# Altium project TemCtrl.PrjPCB
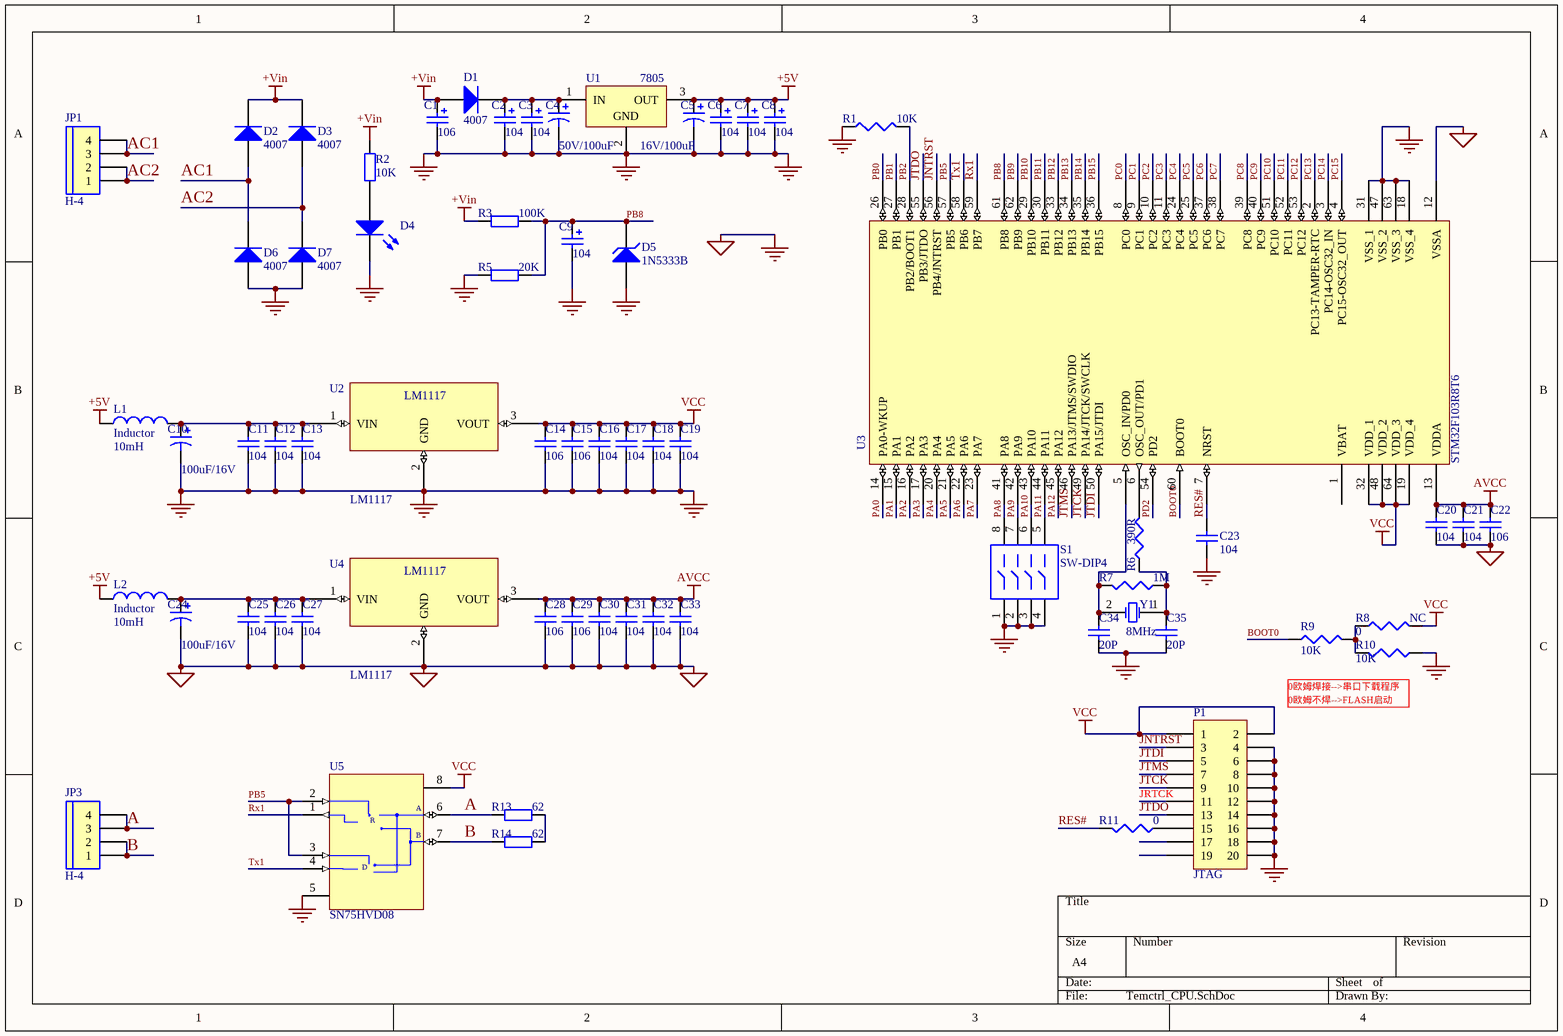
[diagram p0: Temctrl_CPU.SchDoc]
3 sheets, 243 parts. Net scope: global (net labels, ports and power ports of the same name join across sheets).
Board file: Temctrl.PcbDoc
Sheets:
  Temctrl_CPU.SchDoc
  Temctrl_I.SchDoc
  Temctrl_O.SchDoc

## Sheet Temctrl_CPU.SchDoc
size A4

### Parts
C1  106  [0805]
C2  104  [0805]
C3  104  [0805]
C4  50V/100uF  [50V/100uF SOC]
C5  16V/100uF  [100/16V   SOC]
C6  104  [0805]
C7  104  [0805]
C8  104  [0805]
C9  104  [0805]
C10  100uF/16V  [100/16V   SOC]
C11  104  [0805]
C12  104  [0805]
C13  104  [0805]
C14  106  [0805]
C15  106  [0805]
C16  104  [0805]
C17  104  [0805]
C18  104  [0805]
C19  104  [0805]
C20  104  [0805]
C21  104  [0805]
C22  106  [0805]
C23  104  [0805]
C24  100uF/16V  [100/16V   SOC]
C25  104  [0805]
C26  104  [0805]
C27  104  [0805]
C28  106  [0805]
C29  106  [0805]
C30  104  [0805]
C31  104  [0805]
C32  104  [0805]
C33  104  [0805]
C34  20P  [0805]
C35  20P  [0805]
D1  4007  [DIODE0.4]
D2  4007  [DIODE0.4]
D3  4007  [DIODE0.4]
D4  LED0  [LED0.1-0.22]  (value not drawn)
D5  1N5333B  [DIODE0.4]
D6  4007  [DIODE0.4]
D7  4007  [DIODE0.4]
JP1  H-4  [P4]
JP3  H-4  [P4]
L1  Inductor  value 10mH  [0805]
L2  Inductor  value 10mH  [0805]
P1  JTAG  [HDR2X10]
R1  10K  [0805]
R2  10K  [0805]
R3  100K  [0805]
R5  20K  [0805]
R6  390R  [0805]
R7  1M  [0805]
R8  NC  value 0  [0805]
R9  10K  [0805]
R10  10K  [0805]
R11  0  [0805]
R13  62  [0805]
R14  62  [0805]
S1  SW-DIP4  [SW-DIP-4]
U1  7805  [SIP-W3 /SRQ25]
U2  LM1117  [DSO-G3/P2.3]
U3  STM32F103R8T6  [LQFP64_N]
U4  LM1117  [DSO-G3/P2.3]
U5  SN75HVD08  [SOP8-max485]
Y1  value 8MHz  [XTL]  (hidden comment: XTAL)

### Nets
+5V: C5.1 C6.1 C7.1 C8.1 L1.1 L2.1 U1.3(OUT)
+Vin: C1.1 D1.1(A) D2.2(K) D3.2(K) R2.1 R3.2
AGND: C1.2 C2.2 C3.2 C4.2 C5.2 C6.2 C7.2 C8.2 C9.2 C10.2 C11.2 C12.2 C13.2 C14.2 C15.2 C16.2 C17.2 C18.2 C19.2 C20.1 C21.1 C22.1 C23.2 C24.2 C25.2 C26.2 C27.2 C28.2 C29.2 C30.2 C31.2 C32.2 C33.2 C34.1 C35.1 D4.2(K) D5.1(A) D6.1(A) D7.1(A) P1.4 P1.6 P1.8 P1.10 P1.12 P1.14 P1.16 P1.18 P1.20 R1.1 R5.2 R10.1 S1.1 S1.2 S1.3 S1.4 U1.2(GND) U2.2(GND) U3.12(VSSA) U3.18(VSS_4) U3.31(VSS_1) U3.47(VSS_2) U3.63(VSS_3) U4.2(GND) U5.5(GND)  [also labelled GND]
AVCC: C20.2 C21.2 C22.2 C28.1 C29.1 C30.1 C31.1 C32.1 C33.1 U3.13(VDDA) U4.3(VOUT)
VCC: C14.1 C15.1 C16.1 C17.1 C18.1 C19.1 P1.1 P1.2 R8.2 U2.3(VOUT) U3.19(VDD_4) U3.32(VDD_1) U3.48(VDD_2) U3.64(VDD_3) U5.8(VCC)
A: JP3.3 JP3.4 R13.2 U5.6(A)
AC1: D2.1(A) D6.2(K) JP1.3 JP1.4
AC2: D3.1(A) D7.2(K) JP1.1 JP1.2
B: JP3.1 JP3.2 R14.2 U5.7(B)
BOOT0: R9.1 U3.60(BOOT0)
JNTRST: P1.3 U3.56(PB4/JNTRST)
JTCK: P1.9 U3.49(PA14/JTCK/SWCLK)
JTDI: P1.5 U3.50(PA15/JTDI)
JTDO: P1.13 U3.55(PB3/JTDO)
JTMS: P1.7 U3.46(PA13/JTMS/SWDIO)
PA0: U3.14(PA0-WKUP)
PA1: U3.15(PA1)
PA2: U3.16(PA2)
PA3: U3.17(PA3)
PA4: U3.20(PA4)
PA5: U3.21(PA5)
PA6: U3.22(PA6)
PA7: U3.23(PA7)
PA8: S1.8 U3.41(PA8)
PA9: S1.7 U3.42(PA9)
PA10: S1.6 U3.43(PA10)
PA11: S1.5 U3.44(PA11)
PA12: U3.45(PA12)
PB0: U3.26(PB0)
PB1: U3.27(PB1)
PB2: R1.2 U3.28(PB2/BOOT1)
PB5: U3.57(PB5) U5.2(~{RE}) U5.3(DE)
PB8: C9.1 D5.2(K) R3.1 R5.1 U3.61(PB8)
PB9: U3.62(PB9)
PB10: U3.29(PB10)
PB11: U3.30(PB11)
PB12: U3.33(PB12)
PB13: U3.34(PB13)
PB14: U3.35(PB14)
PB15: U3.36(PB15)
PC0: U3.8(PC0)
PC1: U3.9(PC1)
PC2: U3.10(PC2)
PC3: U3.11(PC3)
PC4: U3.24(PC4)
PC5: U3.25(PC5)
PC6: U3.37(PC6)
PC7: U3.38(PC7)
PC8: U3.39(PC8)
PC9: U3.40(PC9)
PC10: U3.51(PC10)
PC11: U3.52(PC11)
PC12: U3.53(PC12)
PC13: U3.2(PC13-TAMPER-RTC)
PC14: U3.3(PC14-OSC32_IN)
PC15: U3.4(PC15-OSC32_OUT)
PD2: U3.54(PD2)
RES#: C23.1 R11.2 U3.7(NRST)
Rx1: U3.59(PB7) U5.1(RO)
Tx1: U3.58(PB6) U5.4(DI)
NetC2_1: C2.1 C3.1 C4.1 D1.2(K) U1.1(IN)
NetC10_1: C10.1 C11.1 C12.1 C13.1 L1.2 U2.1(VIN)
NetC24_1: C24.1 C25.1 C26.1 C27.1 L2.2 U4.1(VIN)
NetC34_2: C34.2 R7.2 U3.5(OSC_IN/PD0) Y1.2(OSC2)
NetC35_2: C35.2 R6.1 R7.1 Y1.1(OSC1)
NetD4_1: D4.1(A) R2.2
NetP1_15: P1.15 R11.1
NetR6_2: R6.2 U3.6(OSC_OUT/PD1)
NetR8_1: R8.1 R9.2 R10.2
NetR13_1: R13.1 R14.1

Not connected (* = marked no-connect by the designer): P1 11 17 19; U3 1(VBAT)

### Notes on the sheet
- 0欧姆不焊-->FLASH启动
- 0欧姆焊接-->串口下载程序
- JRTCK
- (in symbol MAX485CPA) R; D

### Library data of the parts
C1 C9 = Cap Pol2: Polarized Capacitor (Axial); Manufacturer: Generic Components; Class: Passive; Value: 10uF; Published: 08/06/2000; Publisher: Altium Hobart Technology Centre; SubClass: Capacitor
C2 C3 C6-C8 = Cap Pol2: Polarized Capacitor (Axial); Manufacturer: Generic Components; Class: Passive; Published: 08/06/2000; Publisher: Altium Hobart Technology Centre; SubClass: Capacitor
C4 C5 C10 C24 = Cap Pol1: Polarized Capacitor (Radial); Value: 100pF; Published: 8-Jun-2000; LatestRevisionDate: 17-Jul-2002; LatestRevisionNote: Re-released for DXP Platform.; PackageReference: RB7.6-15; Publisher: Altium Limited
C11-C13 C16-C19 C25-C27 C30-C33 = Cap: Capacitor; Published: 8-Jun-2000; LatestRevisionDate: 17-Jul-2002; LatestRevisionNote: Re-released for DXP Platform.; PackageReference: RAD-0.3; Publisher: Altium Limited; Value: 104
C14 C15 C28 C29 = Cap: Capacitor; Value: 104; Published: 8-Jun-2000; LatestRevisionDate: 17-Jul-2002; LatestRevisionNote: Re-released for DXP Platform.; PackageReference: RAD-0.3; Publisher: Altium Limited
C20 C21 C23 = Cap Semi: Capacitor (Semiconductor SIM Model); Published: 8-Jun-2000; Revision: July-2002: Re-released for DXP Platform.; Publisher: Altium Limited; Value: 104
C22 C34 C35 = Cap Semi: Capacitor (Semiconductor SIM Model); Value: 104; Published: 8-Jun-2000; Revision: July-2002: Re-released for DXP Platform.; Publisher: Altium Limited
D1-D3 D6 D7 = Diode: Default Diode; Manufacturer: Generic Components; Class: Discrete; SubClass: Diode - Switching; Published: 08/06/2000; Publisher: Altium Hobart Technology Centre
D4 = LED0: Typical INFRARED GaAs LED; Published: 8-Jun-2000; LatestRevisionDate: 08-Jul-2005; LatestRevisionNote: Mech Layer 1 removed.; PackageReference: LED-0; Publisher: Altium Limited
D5 = D Zener: Zener Diode; Published: 8-Jun-2000; LatestRevisionDate: 17-Jul-2002; LatestRevisionNote: Re-released for DXP Platform.; PackageReference: DIODE-0.7; Publisher: Altium Limited
JP1 JP3 = H-4: Header, 4-Pin; Manufacturer: Generic Components; Class: Connector
L1 L2 = Inductor: Code_IEC: 1005; Published: 8-Jun-2000; LatestRevisionDate: 17-Jul-2002; LatestRevisionNote: Re-released for DXP Platform.; PackageReference: 0402-A; Publisher: Altium Limited; Code_JEITA: 0402
P1 = Header 10X2: Header, 10-Pin, Dual row; LatestRevisionDate: 17-Jul-2002; LatestRevisionNote: Re-released for DXP Platform.; Publisher: Altium Limited
R1 R6 R7 R9-R11 = Res3: Resistor; Value: 0~200K; Published: 8-Jun-2000; Revision: July-2002: Re-released for DXP Platform.; Publisher: Altium Limited
R2 R3 R5 R13 R14 = Res: Resistor; Manufacturer: Generic Components; Class: Passive; Published: 08/06/2000; Publisher: Altium Hobart Technology Centre; SubClass: Resistor
R8 = Res3: Resistor; Published: 8-Jun-2000; Revision: July-2002: Re-released for DXP Platform.; Publisher: Altium Limited
S1 = SW-DIP4: DIP Switch,4-bit; Manufacturer: Generic Components; Published: 1999
U1 = 78*05
U3 = STM32F103R8T6: STM32 ARM-based 32-bit MCU with 64 Kbytes Flash, 64-pin LQFP, Industrial Temperature; Published: 30-May-2008; DatasheetVersion: rev6, Mar-2008; PackageVersion: Mar-2008; PackageReference: LQFP64; Publisher: Altium Limited; PackageDescription: 64-Pin Low-Profile Quad Flat Pack, 10 x 10 mm Body, 0.5 mm Pitch (LQFP64); ComponentLink1Description: Manufacturer Link; ComponentLink1URL: www.st.com/stm32; ComponentLink2Description: Datasheet; ComponentLink2URL: http://www.st.com/stonline/products/literature/ds/13587.pdf
U5 = MAX485CPA: Low-Power, Slew-Rate-Limited RS-485/RS-422 Transceiver; Manufacturer: Maxim; Class: Communication; Published: 16/01/2001; Publisher: Altium Hobart Technology Centre; SubClass: Transceiver
Y1 = XTAL: Crystal Oscillator; Manufacturer: Generic Components; Published: 08/06/2000; Publisher: Altium Hobart Technology Centre; Class: Oscillator; SubClass: Crystal Oscillator

## Sheet Temctrl_I.SchDoc
size A4
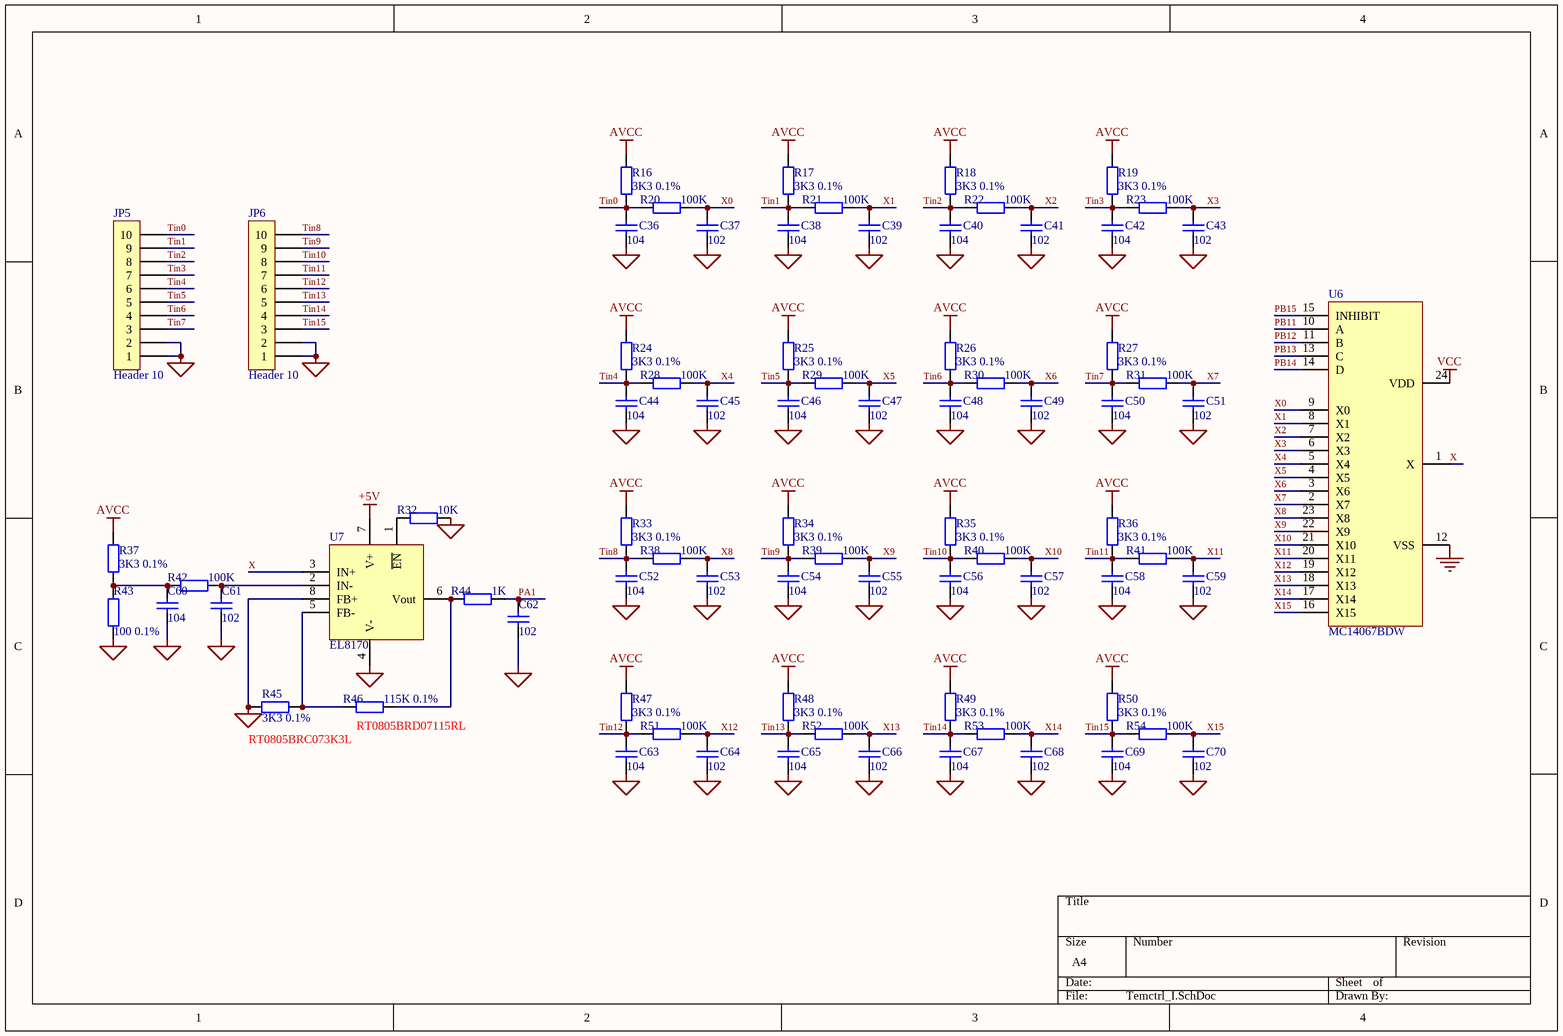
[diagram p1: Temctrl_I.SchDoc]

### Parts
C36  104  [0805]
C37  102  [0805]
C38  104  [0805]
C39  102  [0805]
C40  104  [0805]
C41  102  [0805]
C42  104  [0805]
C43  102  [0805]
C44  104  [0805]
C45  102  [0805]
C46  104  [0805]
C47  102  [0805]
C48  104  [0805]
C49  102  [0805]
C50  104  [0805]
C51  102  [0805]
C52  104  [0805]
C53  102  [0805]
C54  104  [0805]
C55  102  [0805]
C56  104  [0805]
C57  102  [0805]
C58  104  [0805]
C59  102  [0805]
C60  104  [0805]
C61  102  [0805]
C62  102  [0805]
C63  104  [0805]
C64  102  [0805]
C65  104  [0805]
C66  102  [0805]
C67  104  [0805]
C68  102  [0805]
C69  104  [0805]
C70  102  [0805]
JP5  Header 10  [HEAD10B-H - X]
JP6  Header 10  [HEAD10B-H - X]
R16  3K3 0.1%  [0805]
R17  3K3 0.1%  [0805]
R18  3K3 0.1%  [0805]
R19  3K3 0.1%  [0805]
R20  100K  [0805]
R21  100K  [0805]
R22  100K  [0805]
R23  100K  [0805]
R24  3K3 0.1%  [0805]
R25  3K3 0.1%  [0805]
R26  3K3 0.1%  [0805]
R27  3K3 0.1%  [0805]
R28  100K  [0805]
R29  100K  [0805]
R30  100K  [0805]
R31  100K  [0805]
R32  10K  [0805]
R33  3K3 0.1%  [0805]
R34  3K3 0.1%  [0805]
R35  3K3 0.1%  [0805]
R36  3K3 0.1%  [0805]
R37  3K3 0.1%  [0805]
R38  100K  [0805]
R39  100K  [0805]
R40  100K  [0805]
R41  100K  [0805]
R42  100K  [0805]
R43  100 0.1%  [0805]
R44  1K  [0805]
R45  3K3 0.1%  [0805]
R46  115K 0.1%  [0805]
R47  3K3 0.1%  [0805]
R48  3K3 0.1%  [0805]
R49  3K3 0.1%  [0805]
R50  3K3 0.1%  [0805]
R51  100K  [0805]
R52  100K  [0805]
R53  100K  [0805]
R54  100K  [0805]
U6  MC14067BDW  [751E-04_M]
U7  EL8170  [751-06_M]

### Nets
+5V: U7.7(V+)
AGND: C36.2 C37.1 C38.2 C39.1 C40.2 C41.1 C42.2 C43.1 C44.2 C45.1 C46.2 C47.1 C48.2 C49.1 C50.2 C51.1 C52.2 C53.1 C54.2 C55.1 C56.2 C57.1 C58.2 C59.1 C60.1 C61.1 C62.1 C63.2 C64.1 C65.2 C66.1 C67.2 C68.1 C69.2 C70.1 JP5.1 JP5.2 JP6.1 JP6.2 R32.2 R43.1 R45.1 U6.12(VSS) U7.4(V-) U7.8(FB+)  [also labelled GND]
AVCC: R16.2 R17.2 R18.2 R19.2 R24.2 R25.2 R26.2 R27.2 R33.2 R34.2 R35.2 R36.2 R37.2 R47.2 R48.2 R49.2 R50.2
VCC: U6.24(VDD)
PA1: C62.2 R44.2
PB11: U6.10(A)
PB12: U6.11(B)
PB13: U6.13(C)
PB14: U6.14(D)
PB15: U6.15(INHIBIT)
Tin0: C36.1 JP5.10 R16.1 R20.1
Tin1: C38.1 JP5.9 R17.1 R21.1
Tin2: C40.1 JP5.8 R18.1 R22.1
Tin3: C42.1 JP5.7 R19.1 R23.1
Tin4: C44.1 JP5.6 R24.1 R28.1
Tin5: C46.1 JP5.5 R25.1 R29.1
Tin6: C48.1 JP5.4 R26.1 R30.1
Tin7: C50.1 JP5.3 R27.1 R31.1
Tin8: C52.1 JP6.10 R33.1 R38.1
Tin9: C54.1 JP6.9 R34.1 R39.1
Tin10: C56.1 JP6.8 R35.1 R40.1
Tin11: C58.1 JP6.7 R36.1 R41.1
Tin12: C63.1 JP6.6 R47.1 R51.1
Tin13: C65.1 JP6.5 R48.1 R52.1
Tin14: C67.1 JP6.4 R49.1 R53.1
Tin15: C69.1 JP6.3 R50.1 R54.1
X: U6.1(X) U7.3(IN+)
X0: C37.2 R20.2 U6.9(X0)
X1: C39.2 R21.2 U6.8(X1)
X2: C41.2 R22.2 U6.7(X2)
X3: C43.2 R23.2 U6.6(X3)
X4: C45.2 R28.2 U6.5(X4)
X5: C47.2 R29.2 U6.4(X5)
X6: C49.2 R30.2 U6.3(X6)
X7: C51.2 R31.2 U6.2(X7)
X8: C53.2 R38.2 U6.23(X8)
X9: C55.2 R39.2 U6.22(X9)
X10: C57.2 R40.2 U6.21(X10)
X11: C59.2 R41.2 U6.20(X11)
X12: C64.2 R51.2 U6.19(X12)
X13: C66.2 R52.2 U6.18(X13)
X14: C68.2 R53.2 U6.17(X14)
X15: C70.2 R54.2 U6.16(X15)
NetC60_2: C60.2 R37.1 R42.1 R43.2
NetC61_2: C61.2 R42.2 U7.2(IN-)
NetR32_1: R32.1 U7.1(~{EN})
NetR44_1: R44.1 R46.1 U7.6(Vout)
NetR45_2: R45.2 R46.2 U7.5(FB-)

### Notes on the sheet
- RT0805BRC073K3L
- (near R46) RT0805BRD07115RL

### Library data of the parts
C36-C70 = CAP: Capacitor; Manufacturer: Generic Components; Class: Passive; Published: 08/06/2000; Publisher: Altium Hobart Technology Centre; SubClass: Capacitor
JP5 JP6 = Header 10: Header, 10-Pin; Manufacturer: Generic Components; Class: Connector
R16-R54 = Res: as R2 on sheet Temctrl_CPU; Published: 08/06/2000; Publisher: Altium Hobart Technology Centre; SubClass: Resistor
U6 = MC14067

## Sheet Temctrl_O.SchDoc
size A4
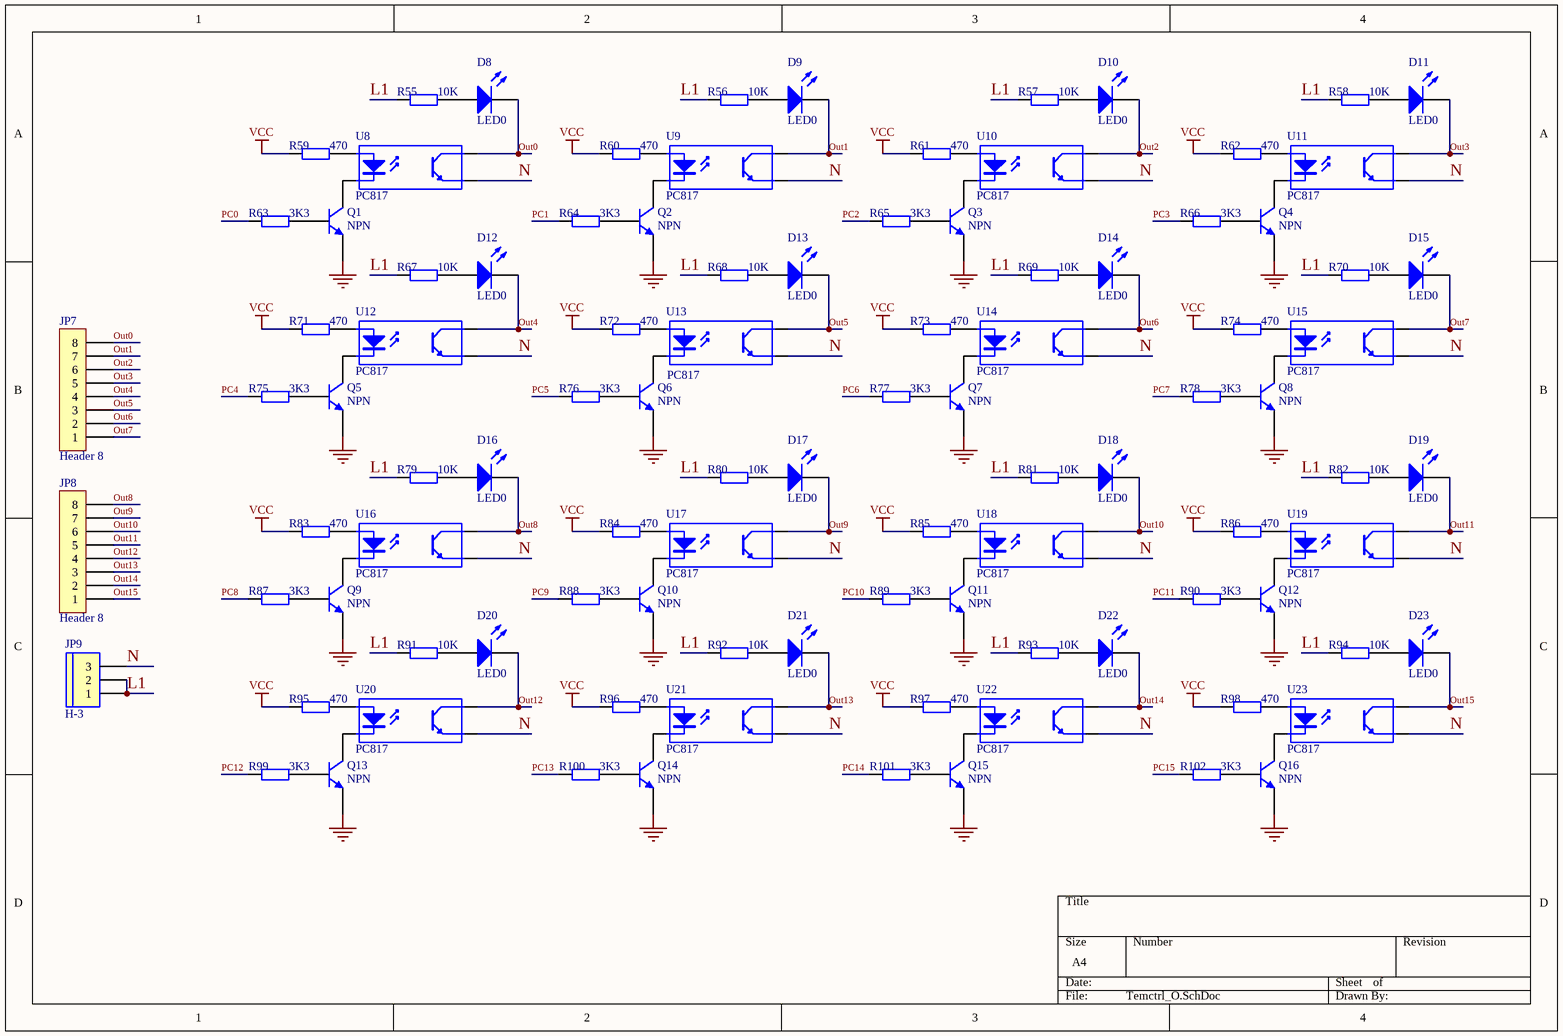
[diagram p2: Temctrl_O.SchDoc]

### Parts
D8  LED0  [LED0.1-0.22]
D9  LED0  [LED0.1-0.22]
D10  LED0  [LED0.1-0.22]
D11  LED0  [LED0.1-0.22]
D12  LED0  [LED0.1-0.22]
D13  LED0  [LED0.1-0.22]
D14  LED0  [LED0.1-0.22]
D15  LED0  [LED0.1-0.22]
D16  LED0  [LED0.1-0.22]
D17  LED0  [LED0.1-0.22]
D18  LED0  [LED0.1-0.22]
D19  LED0  [LED0.1-0.22]
D20  LED0  [LED0.1-0.22]
D21  LED0  [LED0.1-0.22]
D22  LED0  [LED0.1-0.22]
D23  LED0  [LED0.1-0.22]
JP7  Header 8  [HEAD8B-H - X]
JP8  Header 8  [HEAD8B-H - X]
JP9  H-3  [P3]
Q1  NPN  [S9013SMD]
Q2  NPN  [S9013SMD]
Q3  NPN  [S9013SMD]
Q4  NPN  [S9013SMD]
Q5  NPN  [S9013SMD]
Q6  NPN  [S9013SMD]
Q7  NPN  [S9013SMD]
Q8  NPN  [S9013SMD]
Q9  NPN  [S9013SMD]
Q10  NPN  [S9013SMD]
Q11  NPN  [S9013SMD]
Q12  NPN  [S9013SMD]
Q13  NPN  [S9013SMD]
Q14  NPN  [S9013SMD]
Q15  NPN  [S9013SMD]
Q16  NPN  [S9013SMD]
R55  10K  [0805]
R56  10K  [0805]
R57  10K  [0805]
R58  10K  [0805]
R59  470  [0805]
R60  470  [0805]
R61  470  [0805]
R62  470  [0805]
R63  3K3  [0805]
R64  3K3  [0805]
R65  3K3  [0805]
R66  3K3  [0805]
R67  10K  [0805]
R68  10K  [0805]
R69  10K  [0805]
R70  10K  [0805]
R71  470  [0805]
R72  470  [0805]
R73  470  [0805]
R74  470  [0805]
R75  3K3  [0805]
R76  3K3  [0805]
R77  3K3  [0805]
R78  3K3  [0805]
R79  10K  [0805]
R80  10K  [0805]
R81  10K  [0805]
R82  10K  [0805]
R83  470  [0805]
R84  470  [0805]
R85  470  [0805]
R86  470  [0805]
R87  3K3  [0805]
R88  3K3  [0805]
R89  3K3  [0805]
R90  3K3  [0805]
R91  10K  [0805]
R92  10K  [0805]
R93  10K  [0805]
R94  10K  [0805]
R95  470  [0805]
R96  470  [0805]
R97  470  [0805]
R98  470  [0805]
R99  3K3  [0805]
R100  3K3  [0805]
R101  3K3  [0805]
R102  3K3  [0805]
U8  PC817  [DIP-4]
U9  PC817  [DIP-4]
U10  PC817  [DIP-4]
U11  PC817  [DIP-4]
U12  PC817  [DIP-4]
U13  PC817  [DIP-4]
U14  PC817  [DIP-4]
U15  PC817  [DIP-4]
U16  PC817  [DIP-4]
U17  PC817  [DIP-4]
U18  PC817  [DIP-4]
U19  PC817  [DIP-4]
U20  PC817  [DIP-4]
U21  PC817  [DIP-4]
U22  PC817  [DIP-4]
U23  PC817  [DIP-4]

### Nets
GND: Q1.3(E) Q2.3(E) Q3.3(E) Q4.3(E) Q5.3(E) Q6.3(E) Q7.3(E) Q8.3(E) Q9.3(E) Q10.3(E) Q11.3(E) Q12.3(E) Q13.3(E) Q14.3(E) Q15.3(E) Q16.3(E)  [project net AGND]
VCC: R59.1 R60.1 R61.1 R62.1 R71.1 R72.1 R73.1 R74.1 R83.1 R84.1 R85.1 R86.1 R95.1 R96.1 R97.1 R98.1
L1: JP9.1 JP9.2 R55.1 R56.1 R57.1 R58.1 R67.1 R68.1 R69.1 R70.1 R79.1 R80.1 R81.1 R82.1 R91.1 R92.1 R93.1 R94.1
N: JP9.3 U8.3(E) U9.3(E) U10.3(E) U11.3(E) U12.3(E) U13.3(E) U14.3(E) U15.3(E) U16.3(E) U17.3(E) U18.3(E) U19.3(E) U20.3(E) U21.3(E) U22.3(E) U23.3(E)
Out0: D8.2(K) JP7.8 U8.4(C)
Out1: D9.2(K) JP7.7 U9.4(C)
Out2: D10.2(K) JP7.6 U10.4(C)
Out3: D11.2(K) JP7.5 U11.4(C)
Out4: D12.2(K) JP7.4 U12.4(C)
Out5: D13.2(K) JP7.3 U13.4(C)
Out6: D14.2(K) JP7.2 U14.4(C)
Out7: D15.2(K) JP7.1 U15.4(C)
Out8: D16.2(K) JP8.8 U16.4(C)
Out9: D17.2(K) JP8.7 U17.4(C)
Out10: D18.2(K) JP8.6 U18.4(C)
Out11: D19.2(K) JP8.5 U19.4(C)
Out12: D20.2(K) JP8.4 U20.4(C)
Out13: D21.2(K) JP8.3 U21.4(C)
Out14: D22.2(K) JP8.2 U22.4(C)
Out15: D23.2(K) JP8.1 U23.4(C)
PC0: R63.1
PC1: R64.1
PC2: R65.1
PC3: R66.1
PC4: R75.1
PC5: R76.1
PC6: R77.1
PC7: R78.1
PC8: R87.1
PC9: R88.1
PC10: R89.1
PC11: R90.1
PC12: R99.1
PC13: R100.1
PC14: R101.1
PC15: R102.1
NetD8_1: D8.1(A) R55.2
NetD9_1: D9.1(A) R56.2
NetD10_1: D10.1(A) R57.2
NetD11_1: D11.1(A) R58.2
NetD12_1: D12.1(A) R67.2
NetD13_1: D13.1(A) R68.2
NetD14_1: D14.1(A) R69.2
NetD15_1: D15.1(A) R70.2
NetD16_1: D16.1(A) R79.2
NetD17_1: D17.1(A) R80.2
NetD18_1: D18.1(A) R81.2
NetD19_1: D19.1(A) R82.2
NetD20_1: D20.1(A) R91.2
NetD21_1: D21.1(A) R92.2
NetD22_1: D22.1(A) R93.2
NetD23_1: D23.1(A) R94.2
NetQ1_1: Q1.1(C) U8.2(K)
NetQ1_2: Q1.2(B) R63.2
NetQ2_1: Q2.1(C) U9.2(K)
NetQ2_2: Q2.2(B) R64.2
NetQ3_1: Q3.1(C) U10.2(K)
NetQ3_2: Q3.2(B) R65.2
NetQ4_1: Q4.1(C) U11.2(K)
NetQ4_2: Q4.2(B) R66.2
NetQ5_1: Q5.1(C) U12.2(K)
NetQ5_2: Q5.2(B) R75.2
NetQ6_1: Q6.1(C) U13.2(K)
NetQ6_2: Q6.2(B) R76.2
NetQ7_1: Q7.1(C) U14.2(K)
NetQ7_2: Q7.2(B) R77.2
NetQ8_1: Q8.1(C) U15.2(K)
NetQ8_2: Q8.2(B) R78.2
NetQ9_1: Q9.1(C) U16.2(K)
NetQ9_2: Q9.2(B) R87.2
NetQ10_1: Q10.1(C) U17.2(K)
NetQ10_2: Q10.2(B) R88.2
NetQ11_1: Q11.1(C) U18.2(K)
NetQ11_2: Q11.2(B) R89.2
NetQ12_1: Q12.1(C) U19.2(K)
NetQ12_2: Q12.2(B) R90.2
NetQ13_1: Q13.1(C) U20.2(K)
NetQ13_2: Q13.2(B) R99.2
NetQ14_1: Q14.1(C) U21.2(K)
NetQ14_2: Q14.2(B) R100.2
NetQ15_1: Q15.1(C) U22.2(K)
NetQ15_2: Q15.2(B) R101.2
NetQ16_1: Q16.1(C) U23.2(K)
NetQ16_2: Q16.2(B) R102.2
NetR59_2: R59.2 U8.1(A)
NetR60_2: R60.2 U9.1(A)
NetR61_2: R61.2 U10.1(A)
NetR62_2: R62.2 U11.1(A)
NetR71_2: R71.2 U12.1(A)
NetR72_2: R72.2 U13.1(A)
NetR73_2: R73.2 U14.1(A)
NetR74_2: R74.2 U15.1(A)
NetR83_2: R83.2 U16.1(A)
NetR84_2: R84.2 U17.1(A)
NetR85_2: R85.2 U18.1(A)
NetR86_2: R86.2 U19.1(A)
NetR95_2: R95.2 U20.1(A)
NetR96_2: R96.2 U21.1(A)
NetR97_2: R97.2 U22.1(A)
NetR98_2: R98.2 U23.1(A)

### Library data of the parts
D8-D23 = LED0: Typical INFRARED GaAs LED; Published: 8-Jun-2000; LatestRevisionDate: 08-Jul-2005; LatestRevisionNote: Mech Layer 1 removed.; PackageReference: LED-0; Publisher: Altium Limited
JP7 JP8 = Header 8: Header, 8-Pin; Manufacturer: Generic Components; Class: Connector
JP9 = H-3: Header, 3-Pin; Manufacturer: Generic Components; Class: Connector
Q1-Q16 = NPN: NPN Bipolar Transistor; Published: 8-Jun-2000; LatestRevisionDate: 17-Jul-2002; LatestRevisionNote: Re-released for DXP Platform.; PackageReference: TO-226; Publisher: Altium Limited; Code_JEDEC: TO-226-AA
R55-R102 = Res: as R2 on sheet Temctrl_CPU; Published: 08/06/2000; Publisher: Altium Hobart Technology Centre; SubClass: Resistor
U8-U23 = Optoisolator1: 4-Pin Phototransistor Optocoupler; Published: 24-Mar-1999; LatestRevisionDate: 04-Mar-2005; LatestRevisionNote: Sch pins 3 & 4 Swapped.; DatasheetDocument: Nov-2003; PackageReference: DIP-4; Publisher: Altium Limited

## Nets that join several sheets
+5V: Temctrl_CPU (7 pins), Temctrl_I (U7.7)
AGND: Temctrl_CPU (64 pins), Temctrl_I (45 pins), Temctrl_O (16 pins)
AVCC: Temctrl_CPU (11 pins), Temctrl_I (17 pins)
VCC: Temctrl_CPU (15 pins), Temctrl_I (U6.24), Temctrl_O (16 pins)
PA1: Temctrl_CPU (U3.15), Temctrl_I (C62.2 R44.2)
PB11: Temctrl_CPU (U3.30), Temctrl_I (U6.10)
PB12: Temctrl_CPU (U3.33), Temctrl_I (U6.11)
PB13: Temctrl_CPU (U3.34), Temctrl_I (U6.13)
PB14: Temctrl_CPU (U3.35), Temctrl_I (U6.14)
PB15: Temctrl_CPU (U3.36), Temctrl_I (U6.15)
PC0: Temctrl_CPU (U3.8), Temctrl_O (R63.1)
PC1: Temctrl_CPU (U3.9), Temctrl_O (R64.1)
PC2: Temctrl_CPU (U3.10), Temctrl_O (R65.1)
PC3: Temctrl_CPU (U3.11), Temctrl_O (R66.1)
PC4: Temctrl_CPU (U3.24), Temctrl_O (R75.1)
PC5: Temctrl_CPU (U3.25), Temctrl_O (R76.1)
PC6: Temctrl_CPU (U3.37), Temctrl_O (R77.1)
PC7: Temctrl_CPU (U3.38), Temctrl_O (R78.1)
PC8: Temctrl_CPU (U3.39), Temctrl_O (R87.1)
PC9: Temctrl_CPU (U3.40), Temctrl_O (R88.1)
PC10: Temctrl_CPU (U3.51), Temctrl_O (R89.1)
PC11: Temctrl_CPU (U3.52), Temctrl_O (R90.1)
PC12: Temctrl_CPU (U3.53), Temctrl_O (R99.1)
PC13: Temctrl_CPU (U3.2), Temctrl_O (R100.1)
PC14: Temctrl_CPU (U3.3), Temctrl_O (R101.1)
PC15: Temctrl_CPU (U3.4), Temctrl_O (R102.1)